# EAGLE design Nueva PCB V4 (EAGLE 9.6.2)
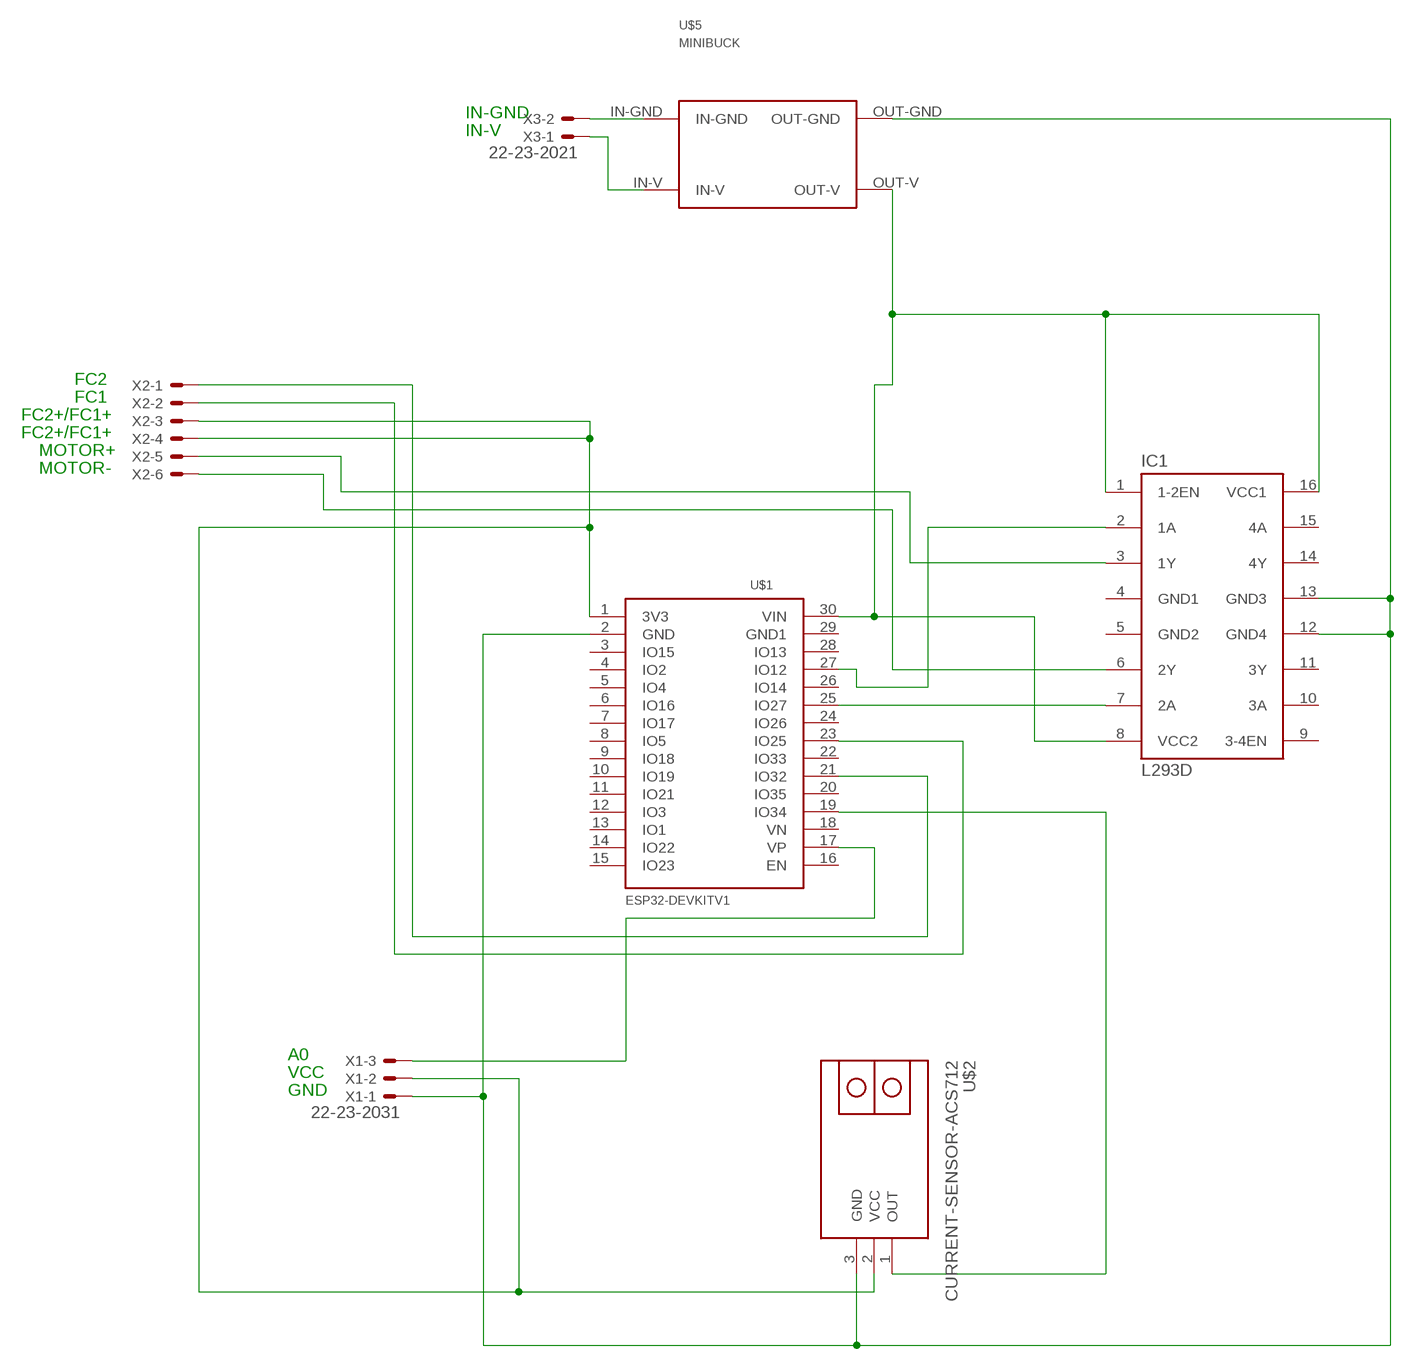
[diagram p0: schematic, sheet 1]

## Parts
IC1  L293D  [DIL16]
U$1  ESP32DEVKITV1  [ESP32-DEVKITV1]
U$2  CURRENT-SENSOR-ACS712  [CURRENT-SENSOR-ACS712]
U$5  MINIBUCK  [BUCK4PINES]
X1  22-23-2031  [22-23-2031]
X2  22-23-2061  [22-23-2061]
X3  22-23-2021  [22-23-2021]

## Nets
GND: IC1.12(GND4) IC1.13(GND3) U$1.2(GND) U$2.3(GND) U$5.OUT-GND X1.1
N$1: U$5.IN-GND X3.2
N$2: U$5.IN-V X3.1
N$3: IC1.1(1-2EN) IC1.8(VCC2) IC1.16(VCC1) U$1.30(VIN) U$5.OUT-V
N$4: IC1.3(1Y) X2.5
N$5: IC1.6(2Y) X2.6
N$6: IC1.2(1A) U$1.27(IO12)
N$7: IC1.7(2A) U$1.25(IO27)
N$8: U$1.1(3V3) U$2.2(VCC) X1.2 X2.3 X2.4
N$9: U$1.23(IO25) X2.2
N$10: U$1.19(IO34) U$2.1(OUT)
N$11: U$1.17(VP) X1.3
N$12: U$1.21(IO32) X2.1
Unconnected: IC1.9(3-4EN) IC1.10(3A) IC1.11(3Y) IC1.14(4Y) IC1.15(4A) U$1.3(IO15) U$1.4(IO2) U$1.5(IO4) U$1.6(IO16) U$1.7(IO17) U$1.8(IO5) U$1.9(IO18) U$1.10(IO19) U$1.11(IO21) U$1.12(IO3) U$1.13(IO1) U$1.14(IO22) U$1.15(IO23) U$1.16(EN) U$1.18(VN) U$1.20(IO35) U$1.22(IO33) U$1.24(IO26) U$1.26(IO14) U$1.28(IO13) U$1.29(GND1)

## Notes on the sheet
- IN-GND
- IN-V
- FC2
- FC1
- FC2+/FC1+
- FC2+/FC1+
- MOTOR+
- MOTOR-
- A0
- VCC
- GND

## Power pins joined to a net without a drawn wire
GND1: IC1.4(GND1)
GND2: IC1.5(GND2)

## Library data of the parts
IC1 = st-microelectronics:L293D: PUSH-PULL 4 CHANNEL DRIVER; MPN: L293D; OC_FARNELL: 9589619; OC_NEWARK: 56P8249
U$1 = ESP32-DEVKITV1:ESP32DEVKITV1
U$2 = diy-modules:CURRENT-SENSOR-ACS712: Isolated Bipolar Current Sensors based on ACS712 chip More details available here: http://embedded-lab.com/blog/a-brief-overview-of-allegro-acs712-current-sensor-part-1/ Click here to find device on ebay.com <http://www.ebay.com/sch/acs712+module> Note: There are many available versions with different pinout. Please check before use
U$5 = minibuck:MINIBUCK
X1 = con-molex:22-23-2031: .100" (2.54mm) Center Header - 3 Pin; MF: MOLEX; MPN: 22-23-2031; OC_FARNELL: 1462950; OC_NEWARK: 30C0862
X2 = con-molex:22-23-2061: .100" (2.54mm) Center Header - 6 Pin; MF: MOLEX; MPN: 22-23-2061; OC_FARNELL: 1462922; OC_NEWARK: 27C1933
X3 = con-molex:22-23-2021: .100" (2.54mm) Center Header - 2 Pin; MF: MOLEX; MPN: 22-23-2021; OC_FARNELL: 1462926; OC_NEWARK: 25C3832

## Module L293D
Ports: 

### Library data of the parts

## Board
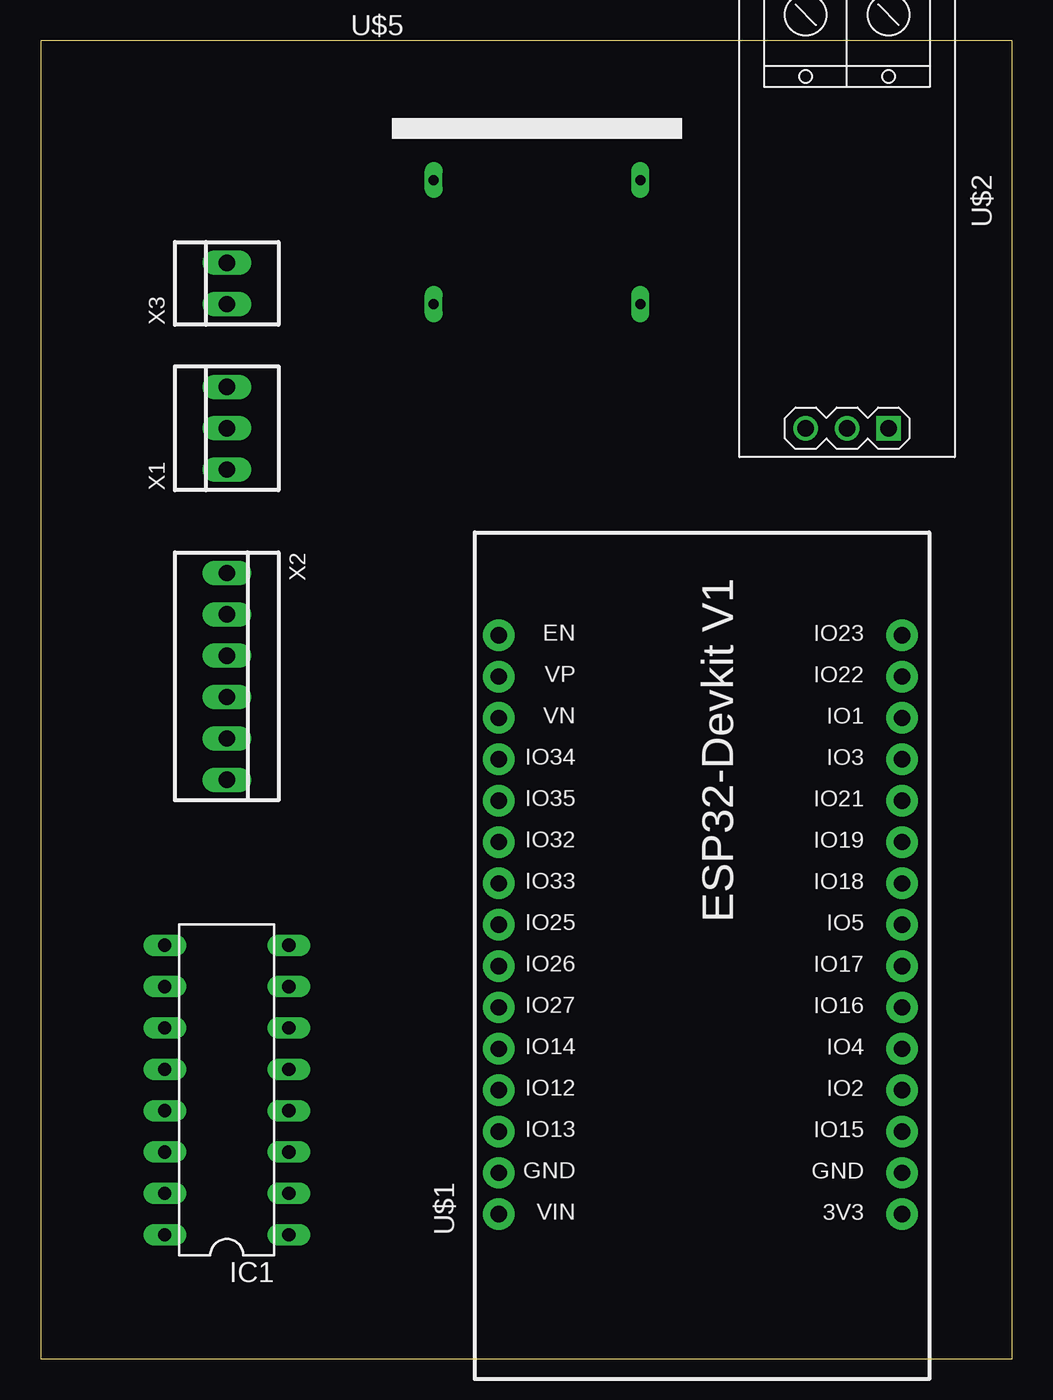
[diagram p1: board, top side]
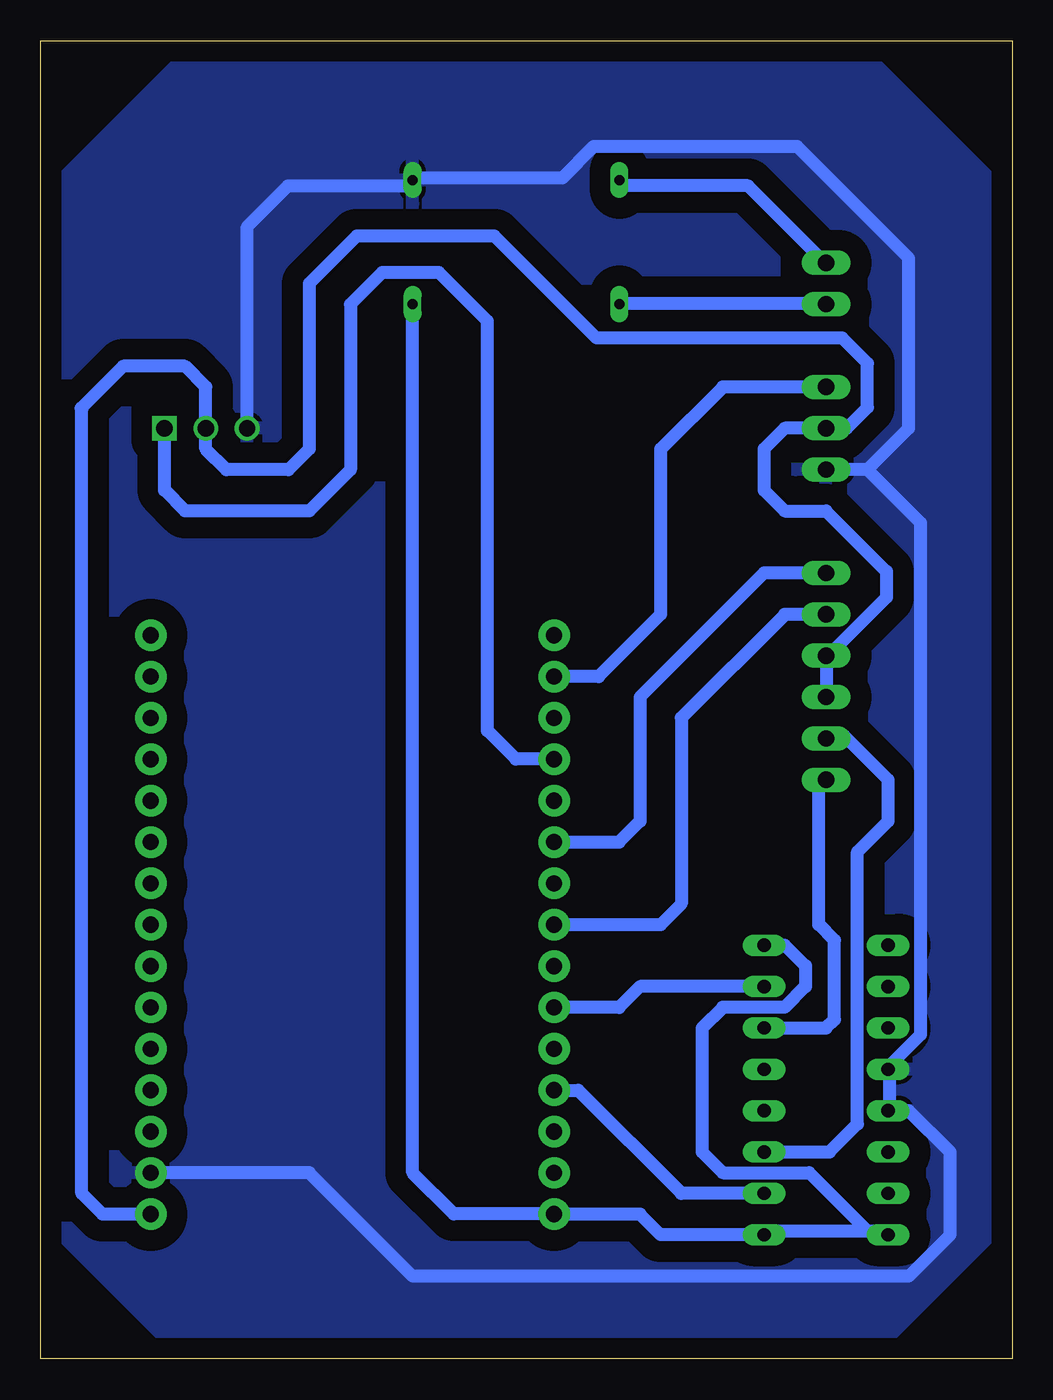
[diagram p2: board, bottom side, seen from below]

Size 59.67 x 80.95 mm. Coordinates in mm from the lower left corner, seen from the top.
Outline: 0,0 59.67,0 59.67,80.95 0,80.95 0,0
Copper layers (1*16): Top 0.035mm / dielectric 1.5mm / Bottom 0.035mm
Design rules "default *": minimum track width 32mil, minimum drill 0.35mm, track to track 6mil, track to pad 6mil, pad to pad 6mil, via to via 6mil, smd to smd 6mil, copper to edge 40mil, drill to drill 6mil, minimum pad ring 10mil, minimum via ring 8mil, stop-mask expansion 4mil, vias tented up to drill 0mil, thermal gap 10mil

### Footprints (pad centres in the part's own frame; a part is rotated, then mirrored left to right if it is on the bottom)
DIL16 = drill 0.813 long: 1 -8.89,-3.81; 2 -6.35,-3.81; 3 -3.81,-3.81; 4 -1.27,-3.81; 5 1.27,-3.81; 6 3.81,-3.81; 7 6.35,-3.81; 8 8.89,-3.81; 9 8.89,3.81; 10 6.35,3.81; 11 3.81,3.81; 12 1.27,3.81; 13 -1.27,3.81; 14 -3.81,3.81; 15 -6.35,3.81; 16 -8.89,3.81
ESP32-DEVKITV1 = drill 1 pad 1.93: 1 -22.87,-13.54; 2 -20.33,-13.54; 3 -17.79,-13.54; 4 -15.25,-13.54; 5 -12.71,-13.54; 6 -10.17,-13.54; 7 -7.63,-13.54; 8 -5.09,-13.54; 9 -2.55,-13.54; 10 -0.01,-13.54; 11 2.53,-13.54; 12 5.07,-13.54; 13 7.61,-13.54; 14 10.15,-13.54; 15 12.69,-13.54; 16 12.69,11.23; 17 10.15,11.23; 18 7.61,11.23; 19 5.07,11.23; 20 2.53,11.23; 21 -0.01,11.23; 22 -2.55,11.23; 23 -5.09,11.23; 24 -7.63,11.23; 25 -10.17,11.23; 26 -12.71,11.23; 27 -15.25,11.23; 28 -17.79,11.23; 29 -20.33,11.23; 30 -22.87,11.23
CURRENT-SENSOR-ACS712 = drill 1 square: 1 13.97,2.54 | drill 1: 2 13.97,0; 3 13.97,-2.54
BUCK4PINES = drill 0.6 long: IN-GND 1.27,8.89; IN-V 1.27,1.27; OUT-GND 13.97,8.89; OUT-V 13.97,1.27
22-23-2031 = drill 1 long: 1 -2.54,0; 2 0,0; 3 2.54,0
22-23-2061 = drill 1 long: 1 -6.35,0; 2 -3.81,0; 3 -1.27,0; 4 1.27,0; 5 3.81,0; 6 6.35,0
22-23-2021 = drill 1 long: 1 -1.27,0; 2 1.27,0

### Placement (x,y rotation side)
IC1  11.43,16.51 90 top
U$1  39.37,31.75 90 top
U$2  49.53,71.12 270 top
U$5  22.86,63.5 0 top
X1  11.43,57.15 90 top
X2  11.43,41.91 270 top
X3  11.43,66.04 90 top

### Tracks (layer width: path | path; a pad name or v marks a point on that pad's centre or on a via)
GND
  Bottom 0.813: U$2.3 46.99,69.52 44.48,72.03 36.98,72.03 U$5.OUT-GND 36.5,72.52 27.64,72.52 25.7,74.45 13.21,74.45 6.35,67.59 6.35,57.15 8.89,54.61 | 8.89,54.61 X1.1 | 8.89,54.61 5.61,51.33 5.61,19.91 7.54,17.98 IC1.12 7.54,17.5 7.54,15.57 IC1.13 6.35,15.24 3.81,12.7 3.81,7.62 6.35,5.08 36.83,5.08 43.18,11.43 53.34,11.43
  pour Bottom (isolate 1.27): 8.89,0 0,8.89 0,71.12 10.16,81.28 49.53,81.28 59.69,71.12 59.69,8.89 50.8,0
N$1
  Bottom 0.813: U$5.IN-GND 23.95,72.03 16.23,72.03 11.89,67.69 X3.2
N$2
  Bottom 0.813: U$5.IN-V 23.95,64.8 11.89,64.8 X3.1
N$3
  Bottom 0.813: 8.89,7.85 14.78,7.85 IC1.1 21.59,7.62 22.85,8.88 U$1.30 34.29,8.89 36.83,11.43 U$5.OUT-V | 8.89,7.85 8.03,7.85 IC1.16 | IC1.8 13.97,25.4 12.7,24.13 12.7,22.86 13.97,21.59 17.78,21.59 19.05,20.32 19.05,12.7 17.78,11.43 12.47,11.43 8.89,7.85
N$4
  Bottom 0.813: X2.5 11.4,38.25 10.31,38.25 7.62,35.56 7.62,33.02 9.5,31.14 9.5,14.43 11.23,12.7 IC1.3
N$5
  Bottom 0.813: X2.6 11.89,35.36 11.89,26.67 10.92,25.7 10.92,20.83 11.43,20.32 IC1.6
N$6
  Bottom 0.813: IC1.2 20.32,10.16 26.66,16.5 U$1.27
N$7
  Bottom 0.813: IC1.7 22.86,22.86 24.14,21.58 U$1.25
N$8
  Bottom 0.813: 11.4,43.08 11.4,40.66 X2.4 | 11.4,43.08 7.72,46.76 7.72,48.36 11.43,52.07 13.97,52.07 15.24,53.34 15.24,55.88 13.97,57.15 X1.2 | 11.89,57.07 X1.2 | 11.4,43.08 X2.3 | X1.2 10.16,57.15 8.89,58.42 8.89,61.14 10.44,62.69 25.53,62.69 31.8,68.96 40.26,68.96 43.18,66.04 43.18,55.88 44.45,54.61 48.26,54.61 49.53,55.88 U$2.2 49.53,59.69 50.8,60.96 54.61,60.96 57.15,58.42 57.15,58.32 | U$1.1 55.87,8.88 57.15,10.16 57.15,58.32 | 57.15,58.32 57.2,58.37
N$9
  Bottom 0.813: X2.2 13.97,45.72 20.32,39.37 20.32,27.94 21.6,26.66 U$1.23
N$10
  Bottom 0.813: U$1.19 30.48,36.83 32.23,38.58 32.23,63.73 35.23,66.73 38.68,66.73 40.64,64.77 40.64,54.61 43.18,52.07 50.8,52.07 52.07,53.34 U$2.1
N$11
  Bottom 0.813: X1.3 17.78,59.69 21.59,55.88 21.59,45.72 25.41,41.9 U$1.17
N$12
  Bottom 0.813: X2.1 15.24,48.26 22.86,40.64 22.86,33.02 24.14,31.74 U$1.21